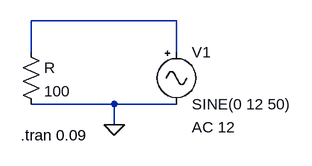
[diagram p0: schematic EXP 1_2.asc]
EXP 1_2.asc, the LTspice schematic file:
Version 4
SHEET 1 880 680
WIRE 288 96 64 96
WIRE 64 144 64 96
WIRE 288 144 288 96
WIRE 192 224 64 224
WIRE 288 224 192 224
WIRE 192 256 192 224
FLAG 192 256 0
SYMBOL res 48 128 R0
SYMATTR InstName R
SYMATTR Value 100
SYMBOL Misc\\signal 288 128 R0
WINDOW 123 24 132 Left 2
WINDOW 39 0 0 Left 0
SYMATTR InstName V1
SYMATTR Value SINE(0 12 50)
SYMATTR Value2 AC 12
TEXT 48 272 Left 2 !.tran 0.09

The netlist it stands for:
* EXP 1_2.asc
R N001 0 100
V1 N001 0 SINE(0 12 50) AC 12
.tran 0.09
.backanno
.end